# EAGLE design PageTurner (EAGLE 9.6.2)
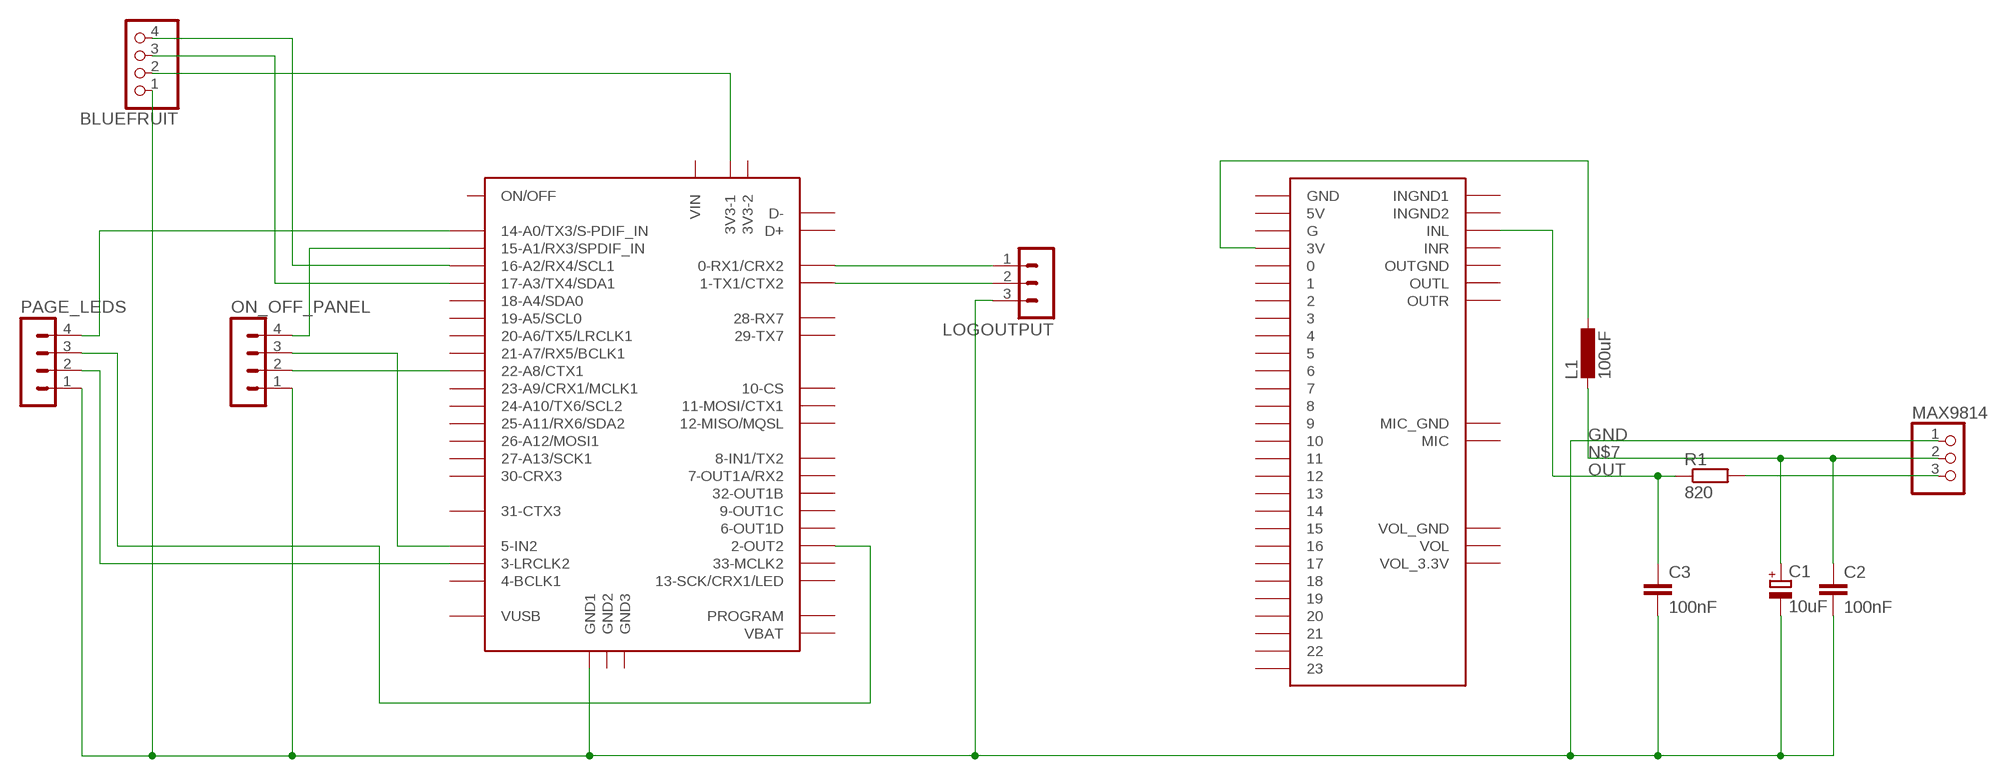
[diagram p0: schematic, sheet 1]

## Parts
BLUEFRUIT  PINHD-1X4  [1X04]
C1  10uF  CPOL-EUE2-4  [E2-4]
C2  100nF  C-EU025-040X050  [C025-040X050]
C3  100nF  C-EU025-040X050  [C025-040X050]
L1  100uF  L-EU0207/5V  [0207/5V]
LOGOUTPUT  MA03-1  [MA03-1]
MAX9814  PINHD-1X3  [1X03]
ON_OFF_PANEL  MA04-1  [MA04-1]
PAGE_LEDS  MA04-1  [MA04-1]
R1  820  R-EU_0207/7  [0207/7]
U$1  TEENSY40  [TEENSY40]
U$2  AUDIOSHIELD  [AUDIOSHIELD]

## Nets
3.3V: BLUEFRUIT.2 U$1.3V3-1
3V: L1.1 U$2.3V
BLE_RX: BLUEFRUIT.3 U$1.17-A3/TX4/SDA1
BLE_TX: BLUEFRUIT.4 U$1.16-A2/RX4/SCL1
GND: BLUEFRUIT.1 C1.- C2.2 C3.2 LOGOUTPUT.3 MAX9814.1 ON_OFF_PANEL.1 PAGE_LEDS.1 U$1.GND1
LOG_RX: LOGOUTPUT.1 U$1.0-RX1(0-RX1/CRX2)
LOG_TX: LOGOUTPUT.2 U$1.1-TX1(1-TX1/CTX2)
N$1: PAGE_LEDS.3 U$1.2-OUT2
N$2: PAGE_LEDS.4 U$1.14-A0/TX3/S-PFI_OUT(14-A0/TX3/S-PDIF_IN)
N$3: ON_OFF_PANEL.4 U$1.15-A1/RX3/S-PDIF_IN(15-A1/RX3/SPDIF_IN)
N$4: MAX9814.3 R1.2
N$5: ON_OFF_PANEL.3 U$1.5-IN2
N$6: ON_OFF_PANEL.2 U$1.22-A8/CTX1
N$7: C1.+ C2.1 L1.2 MAX9814.2
N$8: PAGE_LEDS.2 U$1.3-LRCLK2
OUT: C3.1 R1.1 U$2.INL
Unconnected: U$1.3V3-2 U$1.4-BCLK2(4-BCLK1) U$1.6-OUT1D U$1.7-RX2/OUT1A(7-OUT1A/RX2) U$1.8-TX2/IN1(8-IN1/TX2) U$1.9-OUT1C U$1.10-CS/MQSR(10-CS) U$1.11-MOSI/CTX1 U$1.12-MIO/MQSL(12-MISO/MQSL) U$1.13-SCK/CRX1/LED U$1.18-A4/SDA0 U$1.19-A5/SCL0 U$1.20-A6/TX5/LRCLK1 U$1.21-A7/RX5/BCLK1 U$1.23-A9/CRX1/CCLK1(23-A9/CRX1/MCLK1) U$1.24-A10/TX6/SCL2 U$1.25-A11/SDA2(25-A11/RX6/SDA2) U$1.26-A12/MOSI1 U$1.27-A13/SCK1 U$1.28-RX7 U$1.29-TX7 U$1.30-CRX3 U$1.31-CTX3 U$1.32-OUTB1(32-OUT1B) U$1.33-MCLK2 U$1.D+ U$1.D- U$1.GND2 U$1.GND3 U$1.ON/OFF U$1.PROGRAM U$1.VBAT U$1.VIN U$1.VUSB U$2.0 U$2.1 U$2.2 U$2.3 U$2.4 U$2.5 U$2.5V U$2.6 U$2.7 U$2.8 U$2.9 U$2.10 U$2.11 U$2.12 U$2.13 U$2.14 U$2.15 U$2.16 U$2.17 U$2.18 U$2.19 U$2.20 U$2.21 U$2.22 U$2.23 U$2.G U$2.GND U$2.GND_MIC(MIC_GND) U$2.INGND1 U$2.INGND2 U$2.INR U$2.MIC U$2.OUTGND U$2.OUTL U$2.OUTR U$2.VOL U$2.VOL_3.3V U$2.VOL_GND

## Library data of the parts
BLUEFRUIT = pinhead:PINHD-1X4: PIN HEADER
C1 = rcl:CPOL-EU: POLARIZED CAPACITOR, European symbol; SPICEPREFIX: C
C2 C3 = rcl:C-EU: CAPACITOR, European symbol; SPICEPREFIX: C
L1 = rcl:L-EU: INDUCTOR, European symbol; SPICEPREFIX: L
LOGOUTPUT = con-lstb:MA03-1: PIN HEADER; OC_FARNELL: unknown; OC_NEWARK: unknown
MAX9814 = pinhead:PINHD-1X3: PIN HEADER
ON_OFF_PANEL PAGE_LEDS = con-lstb:MA04-1: PIN HEADER; OC_FARNELL: unknown; OC_NEWARK: unknown
R1 = rcl:R-EU_: RESISTOR, European symbol; SPICEPREFIX: R
U$1 = teensy:TEENSY40: Teensy 4.0 device including POGO pins for pins 24 - 33, but not yet pins for D+ and D-. Symbol layout is what works for me and may not suite everyone... that can be added or additional symbols can be created to be used in a modilied davie name.
U$2 = Teensy_Audioshield:AUDIOSHIELD: Teensy 3 Audioshield by PJRC.COM

## Board
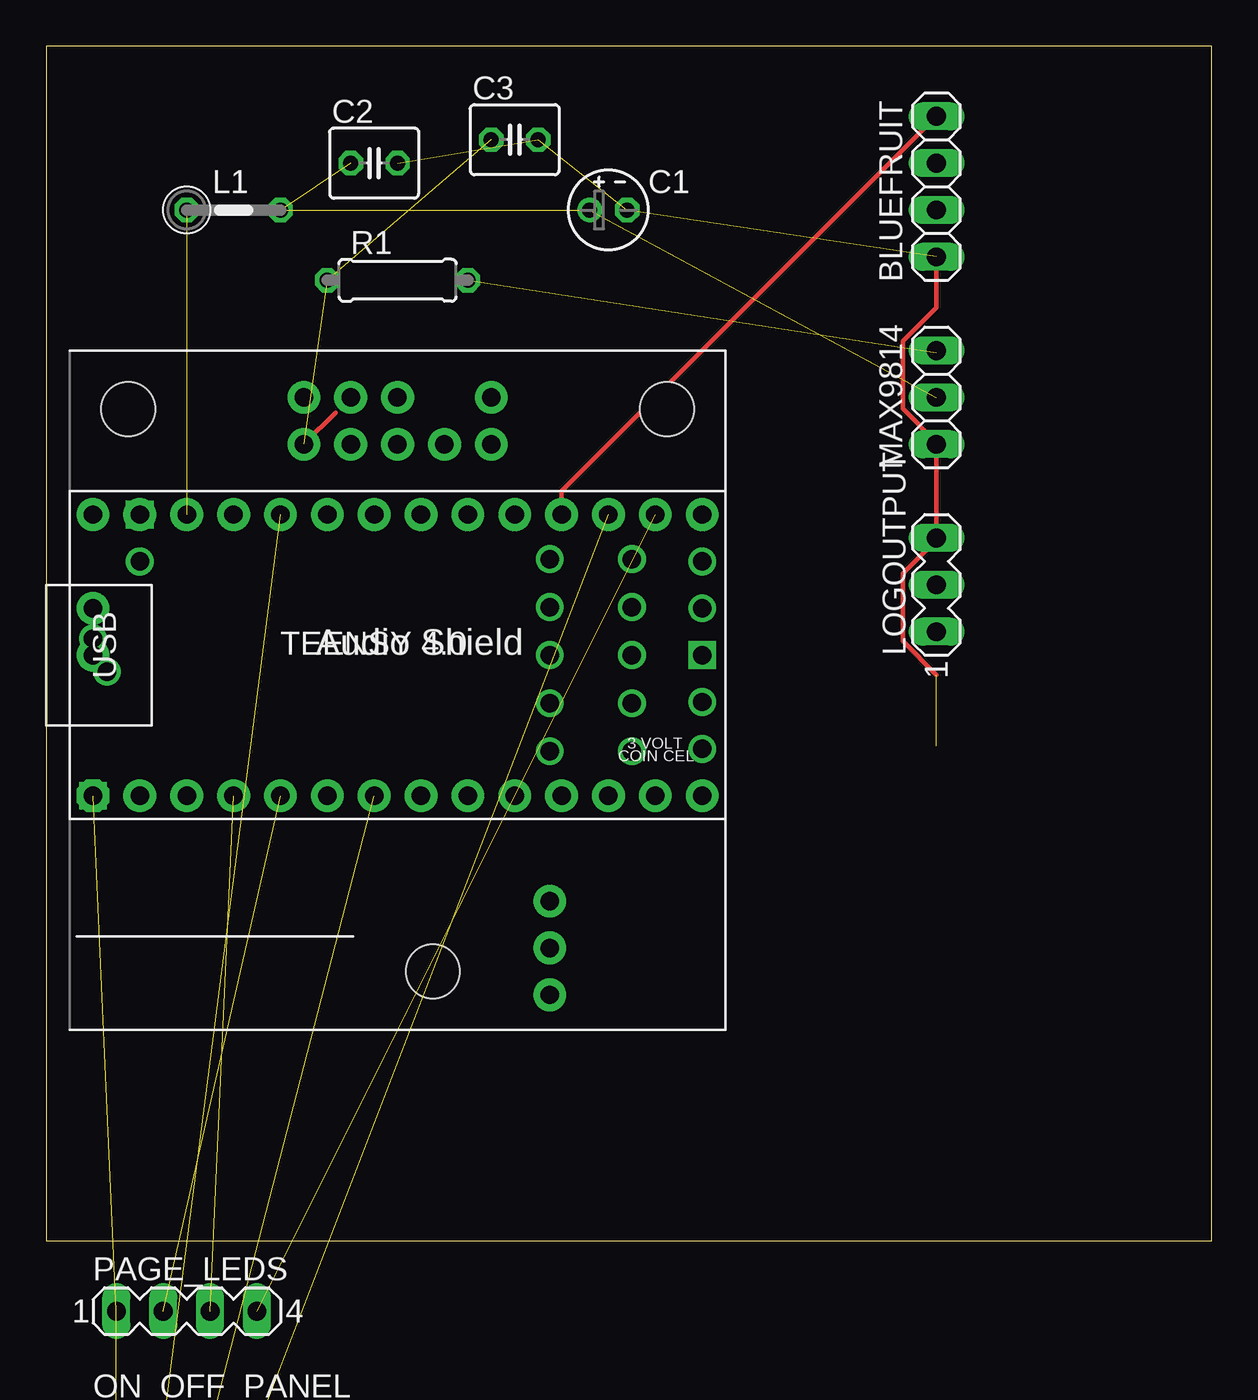
[diagram p1: board, top side]
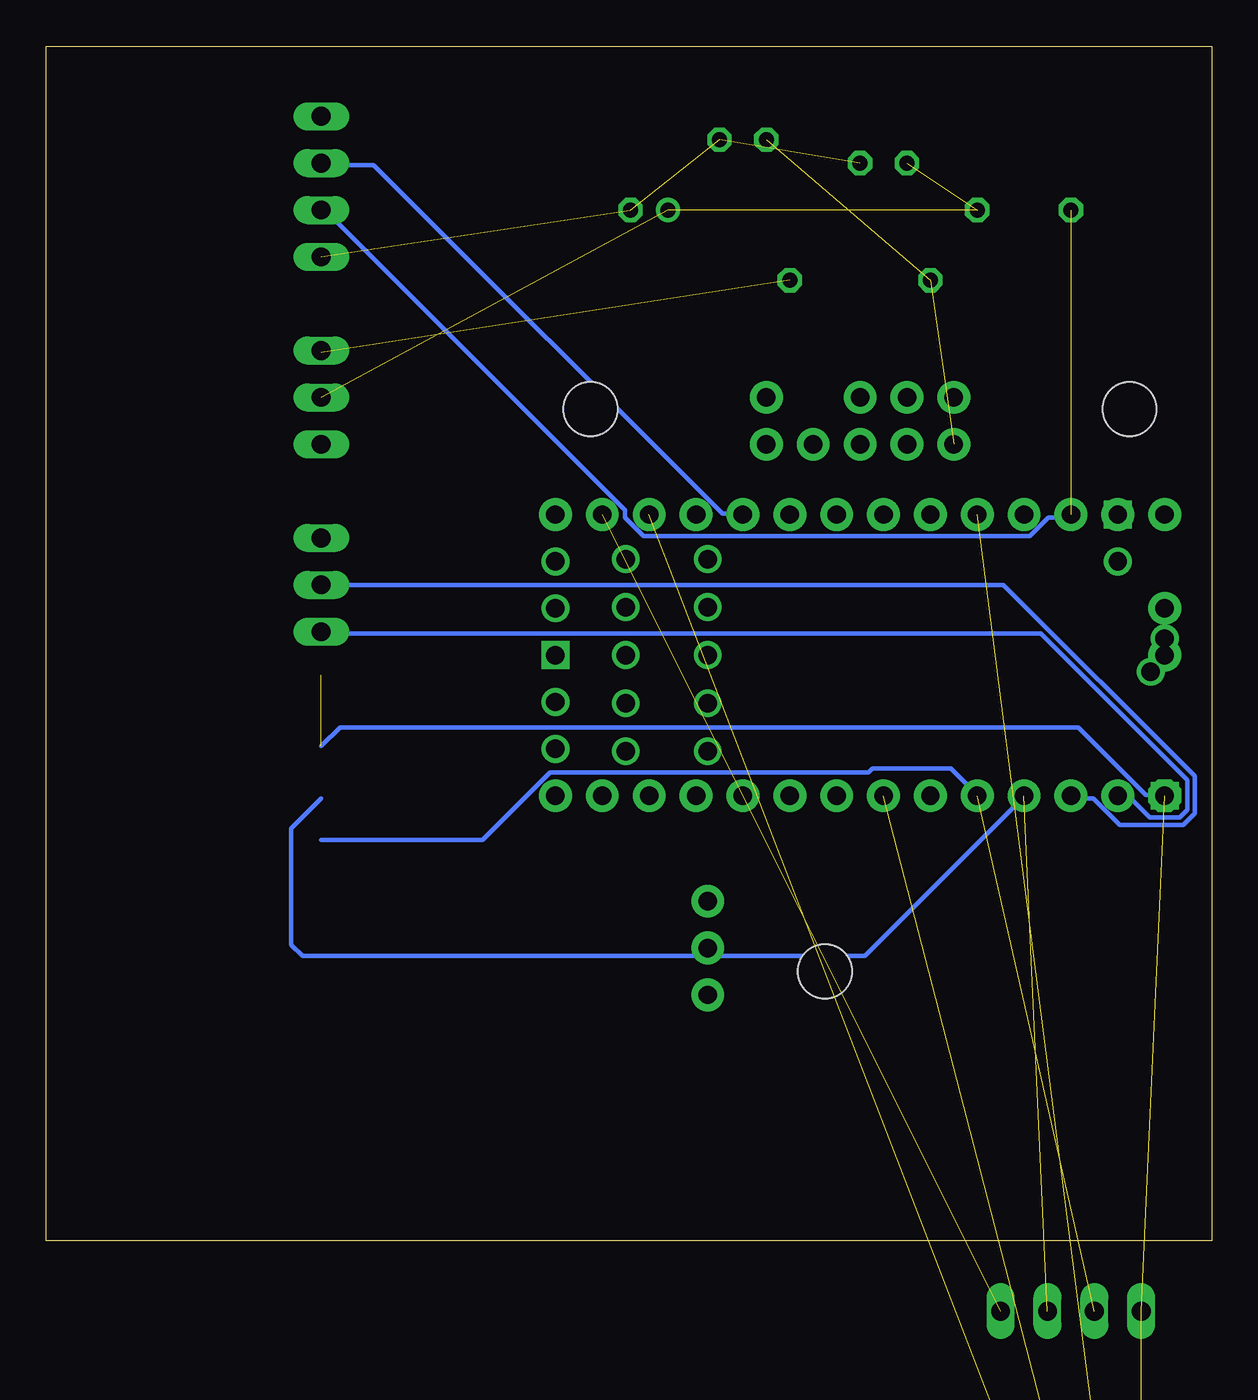
[diagram p2: board, bottom side, seen from below]

Size 63.17 x 64.76 mm. Coordinates in mm from the lower left corner, seen from the top.
Outline: 0,0 63.17,0 63.17,64.76 0,64.76 0,0
Copper layers (1*16): Top 0.035mm / dielectric 1.5mm / Bottom 0.035mm
Design rules "default *": minimum track width 10mil, minimum drill 0.35mm, track to track 6mil, track to pad 6mil, pad to pad 6mil, via to via 6mil, smd to smd 6mil, copper to edge 40mil, drill to drill 6mil, minimum pad ring 10mil, minimum via ring 8mil, stop-mask expansion 4mil, vias tented up to drill 0mil, thermal gap 10mil

### Footprints (pad centres in the part's own frame; a part is rotated, then mirrored left to right if it is on the bottom)
1X04 = drill 1.016 long: 1 -3.81,0; 2 -1.27,0; 3 1.27,0; 4 3.81,0
E2-4 = drill 0.813 pad 1.27: + -1.016,0 | drill 0.813 pad 1.27 octagon: - 1.016,0
C025-040X050 = drill 0.813 octagon: 1 -1.27,0; 2 1.27,0
0207/5V = drill 0.813 octagon: 1 -2.54,0; 2 2.54,0
MA03-1 = drill 1.016 long: 1 -2.54,0; 2 0,0; 3 2.54,0
1X03 = drill 1.016 long: 1 -2.54,0; 2 0,0; 3 2.54,0
MA04-1 = drill 1.016 long: 1 -3.81,0; 2 -1.27,0; 3 1.27,0; 4 3.81,0
0207/7 = drill 0.813 octagon: 1 -3.81,0; 2 3.81,0
TEENSY40 = drill 1: 0-RX1 -13.97,-7.62; 1-TX1 -11.43,-7.62; 2-OUT2 -8.89,-7.62; 3-LRCLK2 -6.35,-7.62; 3V3-2 16.51,-2.54; 4-BCLK2 -3.81,-7.62; 5-IN2 -1.27,-7.62; 6-OUT1D 1.27,-7.62; 7-RX2/OUT1A 3.81,-7.62; 8-TX2/IN1 6.35,-7.62; 9-OUT1C 8.89,-7.62; 10-CS/MQSR 11.43,-7.62; 11-MOSI/CTX1 13.97,-7.62; 12-MIO/MQSL 16.51,-7.62; 13-SCK/CRX1/LED 16.51,7.62; 14-A0/TX3/S-PFI_OUT 13.97,7.62; 15-A1/RX3/S-PDIF_IN 11.43,7.62; 16-A2/RX4/SCL1 8.89,7.62; 17-A3/TX4/SDA1 6.35,7.62; 18-A4/SDA0 3.81,7.62; 19-A5/SCL0 1.27,7.62; 20-A6/TX5/LRCLK1 -1.27,7.62; 21-A7/RX5/BCLK1 -3.81,7.62; 22-A8/CTX1 -6.35,7.62; 23-A9/CRX1/CCLK1 -8.89,7.62; 24-A10/TX6/SCL2 12.7,5.207; 25-A11/SDA2 8.255,5.207; 26-A12/MOSI1 12.7,2.603; 27-A13/SCK1 8.255,2.603; 28-RX7 12.7,0; 29-TX7 8.255,0; 30-CRX3 12.7,-2.603; 31-CTX3 8.255,-2.603; 32-OUTB1 12.7,-5.207; 33-MCLK2 8.255,-5.207; D+ -15.75,-0.9; D- -16.51,0.9; ON/OFF 16.51,5.08; PROGRAM 16.51,2.54; VBAT 16.51,-5.08; VUSB -13.97,5.08 | drill 1 octagon: 3V3-1 -11.43,7.62 | drill 1 square: GND1 -16.51,-7.62; GND2 16.51,0; GND3 -13.97,7.62 | drill 1 pad 1.778: VIN -16.51,7.62
AUDIOSHIELD = drill 1 pad 1.778: 0 -13.97,-5.08; 1 -11.43,-5.08; 2 -8.89,-5.08; 3 -6.35,-5.08; 3V -11.43,10.16; 4 -3.81,-5.08; 5 -1.27,-5.08; 5V -16.51,10.16; 6 1.27,-5.08; 7 3.81,-5.08; 8 6.35,-5.08; 9 8.89,-5.08; 10 11.43,-5.08; 11 13.97,-5.08; 12 16.51,-5.08; 13 16.51,10.16; 14 13.97,10.16; 15 11.43,10.16; 16 8.89,10.16; 17 6.35,10.16; 18 3.81,10.16; 19 1.27,10.16; 20 -1.27,10.16; 21 -3.81,10.16; 22 -6.35,10.16; 23 -8.89,10.16; G -13.97,10.16; GND_MIC -16.51,2.54; INGND1 -5.08,16.51; INGND2 -2.54,16.51; INL -5.08,13.97; INR -2.54,13.97; MIC -16.51,5.08; OUTGND 2.54,13.97; OUTL 5.08,13.97; OUTR 0,13.97; UNUSED1 0,16.51; UNUSED2 5.08,16.51; VOL 8.255,-13.335; VOL_3.3V 8.255,-15.875; VOL_GND 8.255,-10.795 | drill 1 pad 1.778 octagon: GND -16.51,-5.08 | hole 2.921: 1.905,-14.605; -14.605,15.875; 14.605,15.875

### Placement (x,y rotation side)
BLUEFRUIT  48.26,57.15 90 top
C1  30.48,55.88 0 top
C2  17.78,58.42 0 top
C3  25.4,59.69 0 top
L1  10.16,55.88 0 top
LOGOUTPUT  48.26,35.56 90 top
MAX9814  48.26,45.72 90 top
ON_OFF_PANEL  7.62,-10.16 0 top  (outside the outline)
PAGE_LEDS  7.62,-3.81 0 top  (outside the outline)
R1  19.05,52.07 0 top
U$1  19.05,31.75 0 top
U$2  19.05,29.21 0 top

### Tracks (layer width: path | path; a pad name or v marks a point on that pad's centre or on a via)
3.3V
  Bottom 0.254: BLUEFRUIT.2 48.06,55.88 31.8,39.62 31.8,39.22 30.79,38.2 9.86,38.2 8.84,39.22 7.62,39.22 U$1.3V3-1
3V  (1 unrouted)
  Bottom 0.254: 7.62,39.52 U$2.3V
BLE_RX
  Bottom 0.254: U$1.17-A3/TX4/SDA1 25.5,39.42 26.52,39.42 45.41,58.32 48.26,58.32 BLUEFRUIT.3
BLE_TX
  Top 0.254: U$1.16-A2/RX4/SCL1 27.94,40.64 BLUEFRUIT.4
GND  (6 unrouted)
  Top 0.254: 48.26,30.68 46.43,32.51 46.43,36.17 48.26,38 LOGOUTPUT.3 MAX9814.1 48.26,43.28 46.43,45.11 46.43,48.77 48.26,50.6 BLUEFRUIT.1
  Bottom 0.254: 48.26,26.82 47.24,27.84 7.21,27.84 3.56,24.18 2.54,24.18 U$1.GND1
LOG_RX
  Bottom 0.254: U$1.0-RX1 4.98,23.98 4.37,23.98 3.35,22.96 1.73,22.96 1.32,23.37 1.32,24.99 9.25,32.92 48.26,32.92 LOGOUTPUT.1
LOG_TX
  Bottom 0.254: LOGOUTPUT.2 11.28,35.56 0.91,25.2 0.91,23.16 1.52,22.55 4.98,22.55 6.4,23.98 7.62,23.98 U$1.1-TX1
N$1  (1 unrouted)
  Bottom 0.254: 48.26,23.98 49.89,22.35 49.89,16.05 49.28,15.44 18.8,15.44 10.26,23.98 U$1.2-OUT2
N$2  (1 unrouted)
N$3  (1 unrouted)
N$4  (1 unrouted)
  Top 0.254: 48.26,48.16 MAX9814.3
N$5  (1 unrouted)
N$6  (1 unrouted)
N$7  (3 unrouted)
N$8  (1 unrouted)
  Bottom 0.254: 48.26,21.74 39.52,21.74 35.87,25.4 18.59,25.4 18.39,25.6 14.12,25.6 12.7,24.18 U$1.3-LRCLK2
OUT  (2 unrouted)
  Top 0.254: U$2.INL 15.7,44.91